# EAGLE schematic controller (EAGLE 9.5.2)
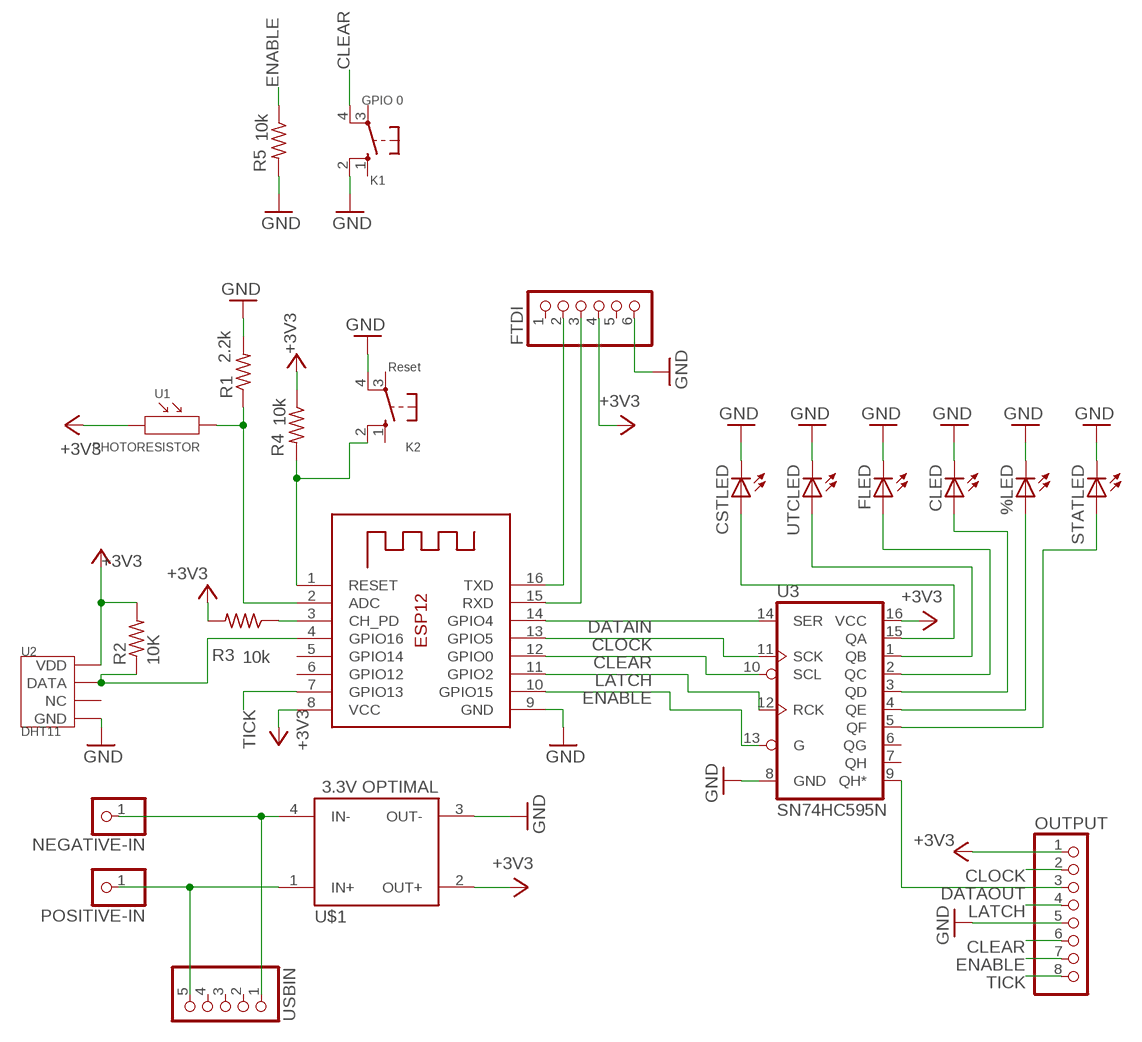
[diagram p0: schematic, sheet 1]

## Parts
%LED  LED5MM  [LED5MM]
CLED  LED5MM  [LED5MM]
CSTLED  LED5MM  [LED5MM]
FLED  LED5MM  [LED5MM]
FTDI  PINHD-1X6/90  [1X06/90]
K1  GPIO 0  40-XX  [B3F-40XX]
K2  Reset  40-XX  [B3F-40XX]
NEGATIVE-IN  PINHD-1X1  [1X01]
OUTPUT  PINHD-1X8/90  [1X08/90]
POSITIVE-IN  PINHD-1X1  [1X01]
R1  2.2k  R-US_0204/7  [0204/7]
R2  10K  R-US_0204/7  [0204/7]
R3  10k  R-US_0204/7  [0204/7]
R4  10k  R-US_0204/7  [0204/7]
R5  10k  R-US_0204/7  [0204/7]
STATLED  LED5MM  [LED5MM]
U1  PHOTORESISTOR  PHOTORESISTOR-5528-10K(2P-5.0X4.2MM)  [SNR2-3.0]
U2  DHT11  TEM-HUM-DHT11(4P-15.5X12.0MM)  [SNR4-2.54-15.5X12.0X5.5MM]
U3  SN74HC595N  74HC595N  [DIP16]
U$1  3.3V OPTIMAL  COMPACTDC-DC  [DIODFN1720X2240X160-4N]
USBIN  PINHD-1X5  [1X05]
UTCLED  LED5MM  [LED5MM]
X1  ESP-12  [ESP-12]

## Nets
+3V3: FTDI.4 OUTPUT.1 R2.2 R3.2 R4.1 U1.1 U2.1(VDD) U3.16(VCC) U$1.2(OUT+) X1.8(VCC)
CLEAR: K1.4(P1) OUTPUT.6 U3.10(SCL) X1.12(GPIO0)
CLOCK: OUTPUT.2 U3.11(SCK) X1.13(GPIO5)
DATAIN: U3.14(SER) X1.14(GPIO4)
DATAOUT: OUTPUT.3 U3.9(QH*)
ENABLE: OUTPUT.7 R5.1 U3.13(G) X1.10(GPIO15)
GND: %LED.K(C) CLED.K(C) CSTLED.K(C) FLED.K(C) FTDI.6 K1.2(S1) K2.4(P1) OUTPUT.5 R1.2 R5.2 STATLED.K(C) U2.4(GND) U3.8(GND) U$1.3(OUT-) UTCLED.K(C) X1.9(GND)
LATCH: OUTPUT.4 U3.12(RCK) X1.11(GPIO2)
N$1: CSTLED.A U3.15(QA)
N$2: U3.1(QB) UTCLED.A
N$3: NEGATIVE-IN.1 U$1.4(IN-) USBIN.1
N$4: POSITIVE-IN.1 U$1.1(IN+) USBIN.5
N$5: R1.1 U1.2 X1.2(ADC)
N$6: FLED.A U3.2(QC)
N$7: CLED.A U3.3(QD)
N$8: %LED.A U3.4(QE)
N$9: STATLED.A U3.5(QF)
N$10: R3.1 X1.3(CH_PD)
N$11: R2.1 U2.2(DATA) X1.4(GPIO16)
N$12: FTDI.2 X1.16(TXD)
N$13: FTDI.3 X1.15(RXD)
N$14: K2.2(S1) R4.2 X1.1(RESET)
TICK: OUTPUT.8 X1.7(GPIO13)
Unconnected: FTDI.1 FTDI.5 K1.1(S) K1.3(P) K2.1(S) K2.3(P) U2.3(NC) U3.6(QG) U3.7(QH) USBIN.2 USBIN.3 USBIN.4 X1.5(GPIO14) X1.6(GPIO12)

## Library data of the parts
%LED CLED CSTLED FLED STATLED UTCLED = adafruit:LED: LED OSRAM: - CHIPLED LG R971, LG N971, LY N971, LG Q971, LY Q971, LO R971, LY R971 LH N974, LH R974 LS Q976, LO Q976, LY Q976 LO Q996 - Hyper CHIPLED LW Q18S LB Q993, LB Q99A, LB R99A - SideLED LS A670, LO A670, LY A670, LG A670, LP A670 LB A673, LV A673, LT A673, LW A673 LH A674 LY A675 LS A676, LA A676, LO A676, LY A676, LW A676 LS A679, LY A679, LG A679 - Hyper Micro SIDELED® LS Y876, LA Y876, LO Y876, LY Y876 LT Y87S - SmartLED LW L88C, LW L88S LB L89C, LB L89S, LG L890 LS L89K, LO L89K, LY L89K LS L896, LA L896, LO L896, LY L896 - TOPLED LS T670, LO T670, LY T670, LG T670, LP T670 LSG T670, LSP T670, LSY T670, LOP T670, LYG T670 LG T671, LOG T671, LSG T671 LB T673, LV T673, LT T673, LW T673 LH T674 LS T676, LA T676, LO T676, LY T676, LB T676, LH T676, LSB T676, LW T676 LB T67C, LV T67C, LT T67C, LS T67K, LO T67K, LY T67K, LW E67C LS E67B, LA E67B, LO E67B, LY E67B, LB E67C, LV E67C, LT E67C LW T67C LS T679, LY T679, LG T679 LS T770, LO T770, LY T770, LG T770, LP T770 LB T773, LV T773, LT T773, LW T773 LH T774 LS E675, LA E675, LY E675, LS T675 LS T776, LA T776, LO T776, LY T776, LB T776 LHGB T686 LT T68C, LB T68C - Hyper Mini TOPLED® LB M676 - Mini TOPLED Santana® LG M470 LS M47K, LO M47K, LY M47K Source: http://www.osram.convergy.de/
FTDI = pinhead:PINHD-1X6: PIN HEADER
K1 K2 = switch-omron:40-XX: OMRON SWITCH; MF: OMRON COMPONENTS USA; MPN: B3F-4000; OC_FARNELL: 176434; OC_NEWARK: 36K3105
NEGATIVE-IN POSITIVE-IN = pinhead:PINHD-1X1: PIN HEADER
OUTPUT = pinhead:PINHD-1X8: PIN HEADER
R1-R5 = resistor:R-US_: RESISTOR, American symbol
U1 = OPL_Sensor-Transducer:PHOTORESISTOR-5528-10K(2P-5.0X4.2MM): 314020017; MPN: PHOTORESISTOR-5528-10K; VALUE: PHOTORESISTOR-5528-10K
U2 = OPL_Sensor-Transducer:TEM-HUM-DHT11(4P-15.5X12.0MM): 314010000; MPN: DHT11
U3 = SparkFun-IC-Logic:74*595: 8-Bit Shift Register (Serial to Parallel) Datasheet <http://cdn.sparkfun.com/datasheets/BreakoutBoards/MM74HC595.pdf> SparkFun Products SparkFun Shift Register Breakout - 74HC595 <https://www.sparkfun.com/products/10680> (BOB-10680); PROD_ID: IC-13123
U$1 = DIODFN1720X2240X160-4N:COMPACTDC-DC
USBIN = pinhead:PINHD-1X5: PIN HEADER
X1 = adafruit:ESP-12